# EAGLE schematic MOD-v1.1-1 (EAGLE 8.2.2)
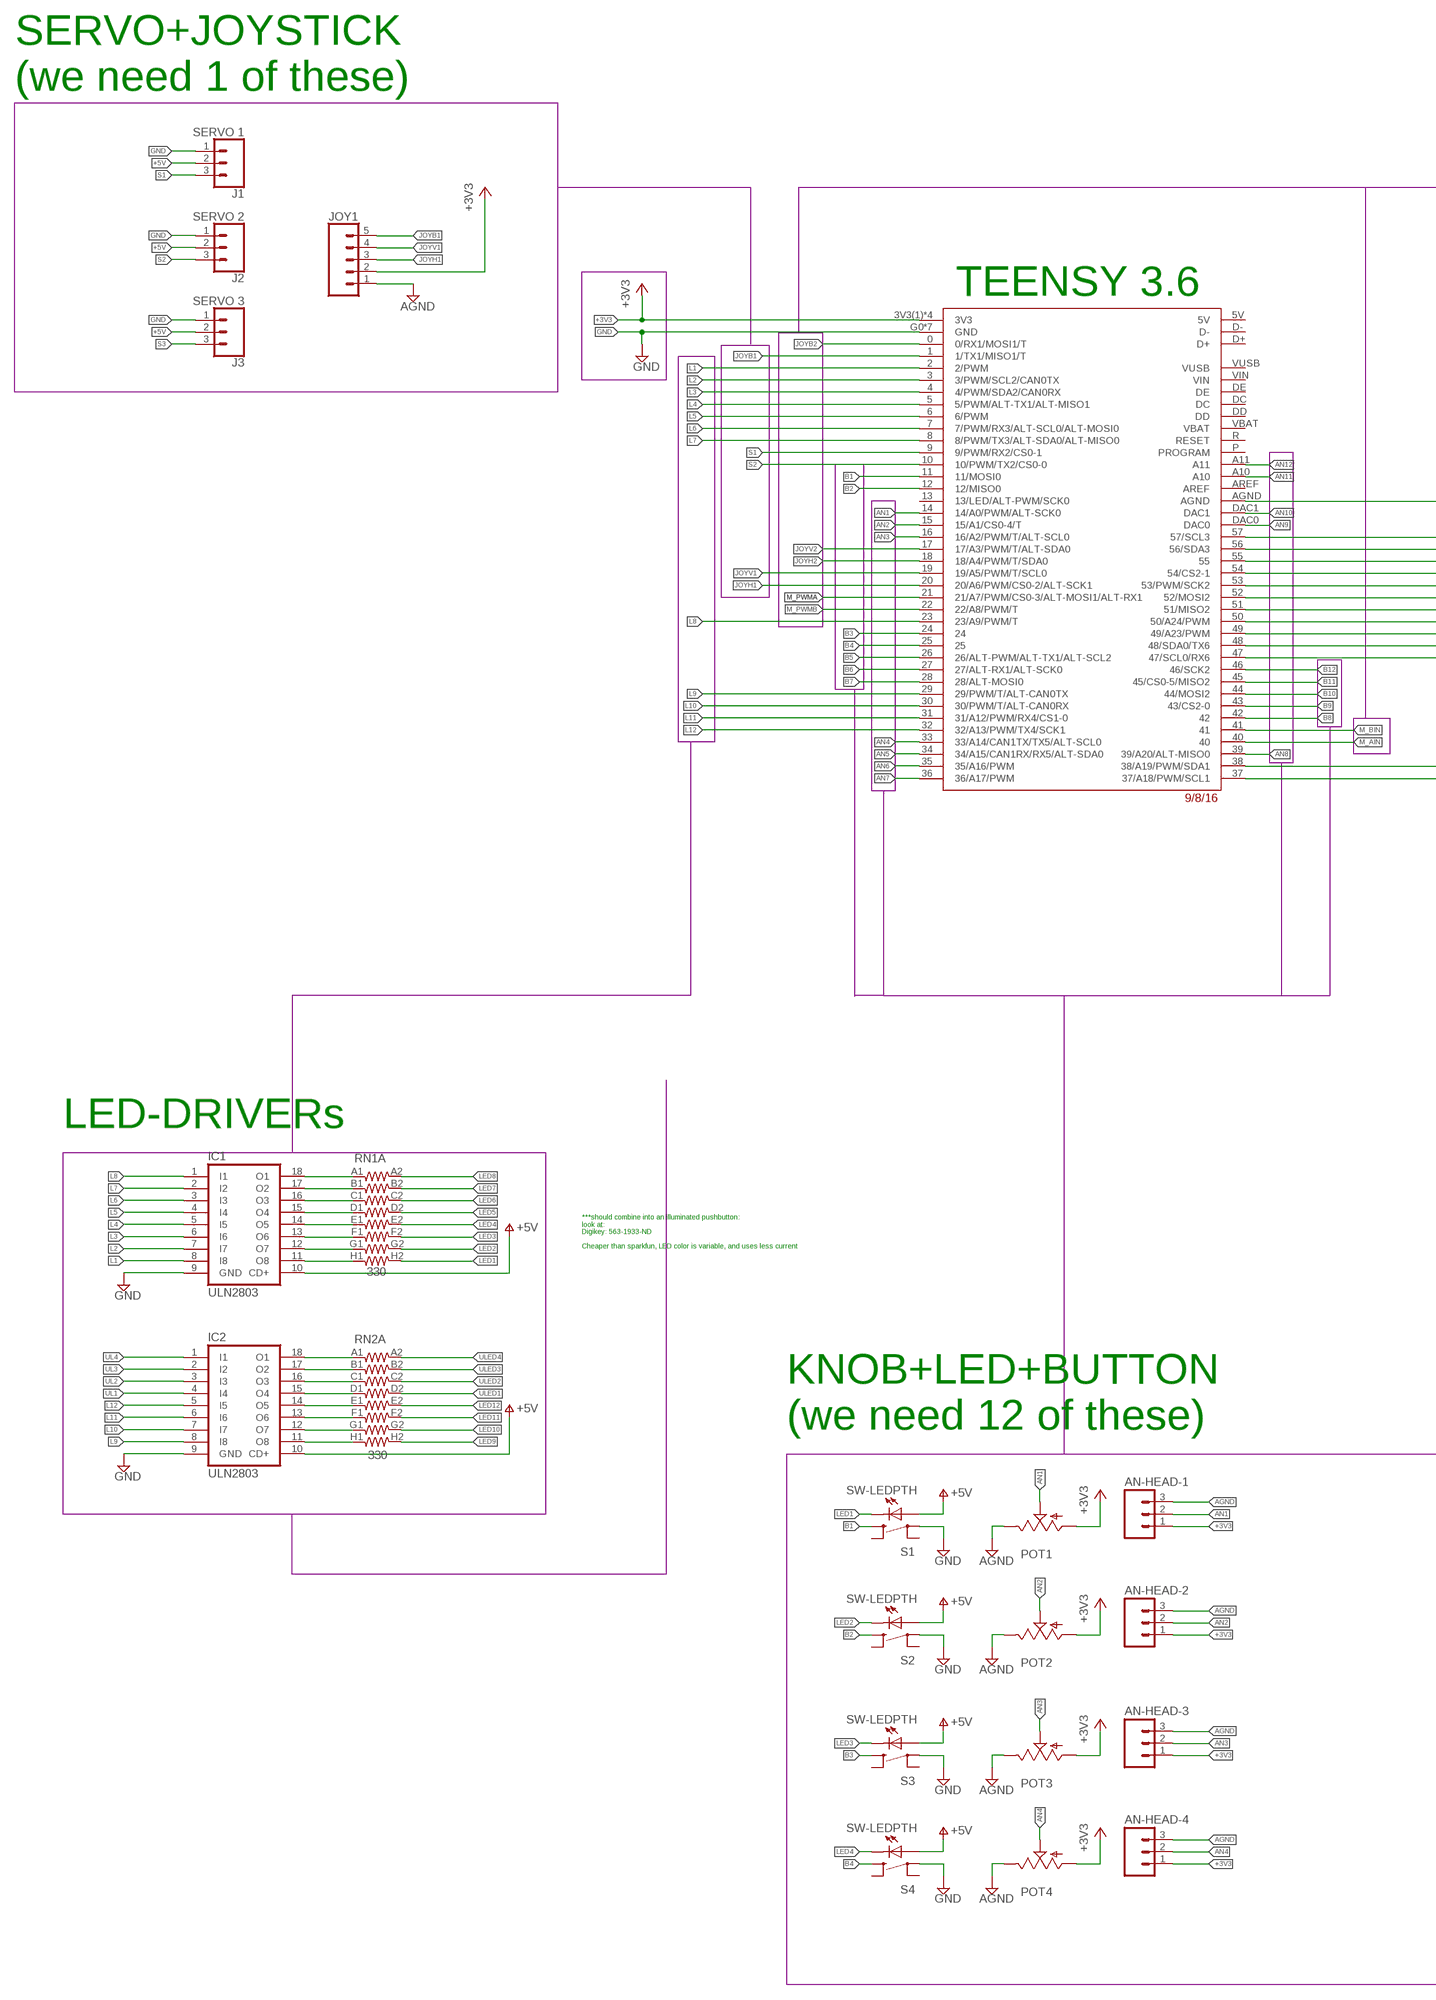
[diagram p0: schematic, sheet 1, part 1 of 2]
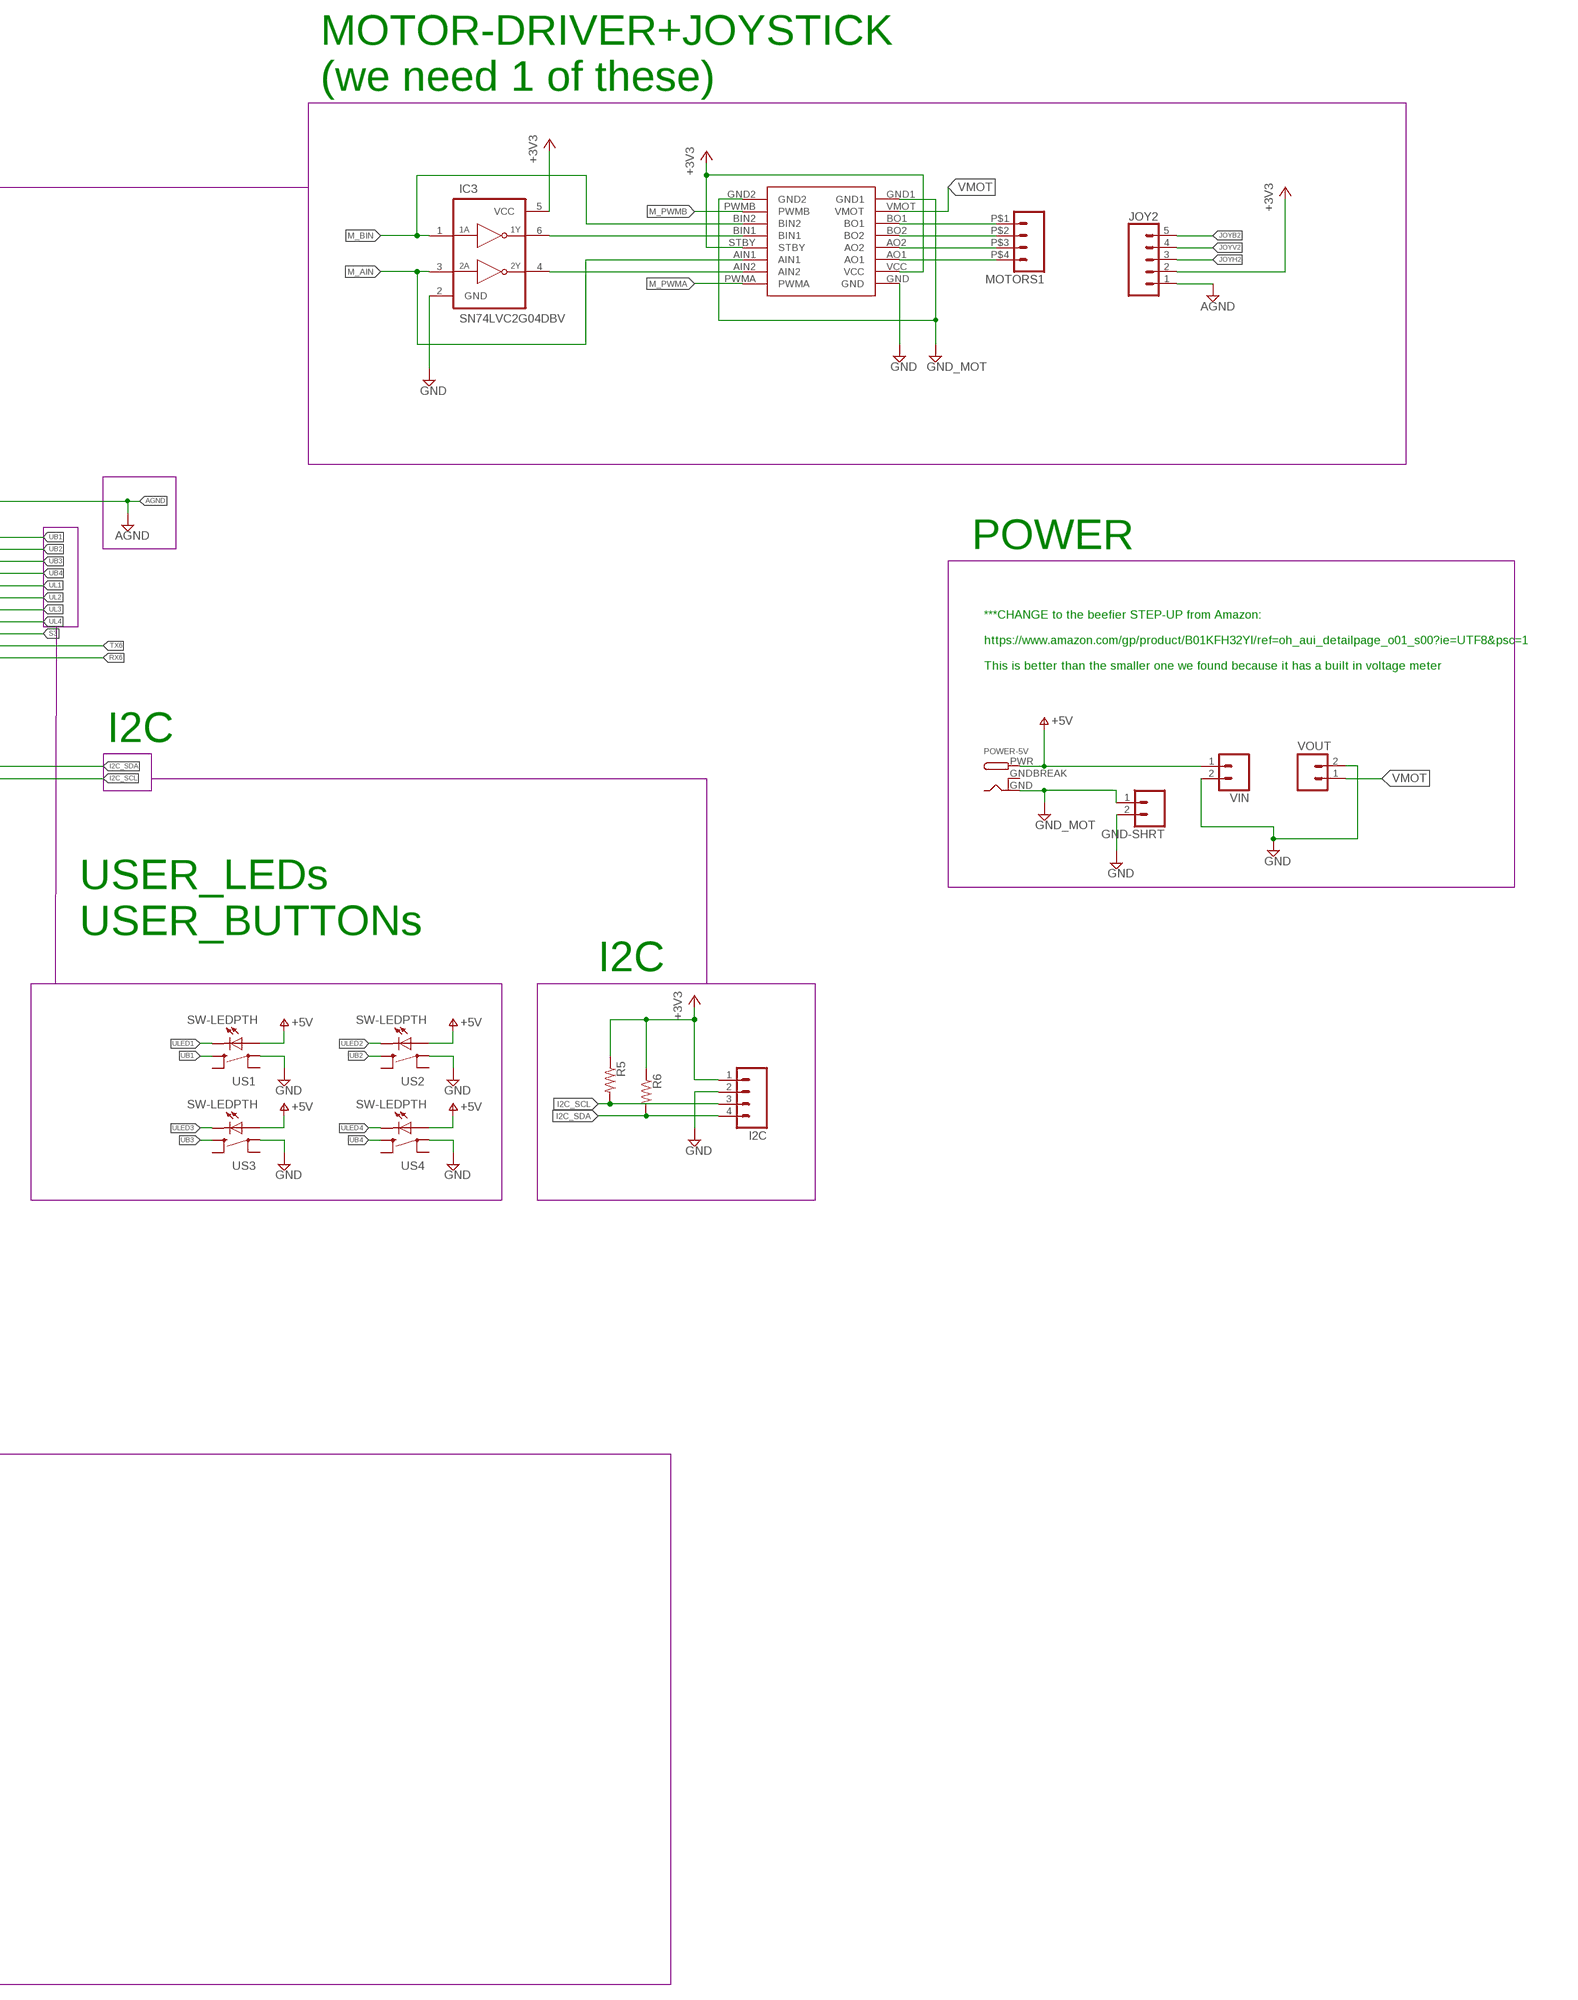
[diagram p1: schematic, sheet 1, part 2 of 2]

## Parts
AN-HEAD-1  M031X03_NO_SILK  [1X03_NO_SILK]
AN-HEAD-2  M031X03_NO_SILK  [1X03_NO_SILK]
AN-HEAD-3  M031X03_NO_SILK  [1X03_NO_SILK]
AN-HEAD-4  M031X03_NO_SILK  [1X03_NO_SILK]
GND-SHRT  M02LOCK  [1X02_LOCK]
I2C  M04LOCK  [1X04_LOCK]
IC1  ULN2803  ULN2803A  [DIL18]
IC2  ULN2803  ULN2803A  [DIL18]
IC3  SN74LVC2G04DBV  [SOT23-6]
J1  SERVO 1  CONN_03LOCK  [1X03_LOCK@1]
J2  SERVO 2  CONN_03LOCK  [1X03_LOCK@1]
J3  SERVO 3  CONN_03LOCK  [1X03_LOCK@1]
JOY1  CONN_05LOCK  [1X05_LOCK]
JOY2  CONN_05LOCK  [1X05_LOCK]
MOTORS1  M04  [SPRINGTERMINAL-2.54MM-4]
POT1  TRIM  [TRIM-PCB-9MM]
POT2  TRIM  [TRIM-PCB-9MM]
POT3  TRIM  [TRIM-PCB-9MM]
POT4  TRIM  [TRIM-PCB-9MM]
POWER-5V  DCBARRELPTH  [DCJACK_2MM_PTH]
R5  RESISTORPTH-1/6W  [1/6W-RES]
R6  RESISTORPTH-1/6W  [1/6W-RES]
RN1  330  RESISTOR-NET-8PDIL16  [RESISTOR-NET-8P-DIL16]
RN2  330  RESISTOR-NET-8PDIL16  [RESISTOR-NET-8P-DIL16]
S1  SW-LEDPTH  [TR2-SWITCH-MOMENTARY-LED]
S2  SW-LEDPTH  [TR2-SWITCH-MOMENTARY-LED]
S3  SW-LEDPTH  [TR2-SWITCH-MOMENTARY-LED]
S4  SW-LEDPTH  [TR2-SWITCH-MOMENTARY-LED]
TEENSY  TEENSY3_6--ALLPINS  [T36]
U$7  POLOLU_TB6612FNG  [POLOLU_TB6612FNG]
US1  SW-LEDPTH  [TR2-SWITCH-MOMENTARY-LED]
US2  SW-LEDPTH  [TR2-SWITCH-MOMENTARY-LED]
US3  SW-LEDPTH  [TR2-SWITCH-MOMENTARY-LED]
US4  SW-LEDPTH  [TR2-SWITCH-MOMENTARY-LED]
VIN  M02LOCK  [1X02_LOCK]
VOUT  M02LOCK  [1X02_LOCK]

## Nets
+3V3: AN-HEAD-1.1 AN-HEAD-2.1 AN-HEAD-3.1 AN-HEAD-4.1 I2C.1 IC3.5(VCC) JOY1.2 JOY2.2 POT1.1(A) POT2.1(A) POT3.1(A) POT4.1(A) R5.1 R6.1 TEENSY.3V3(1)(3V3) TEENSY.3V3(2)(3V3) TEENSY.3V3(3)(3V3) TEENSY.3V3(4)(3V3) U$7.STBY U$7.VCC
+5V [Power]: IC1.10(CD+) IC2.10(CD+) J1.2 J2.2 J3.2 POWER-5V.PWR VIN.1 ; supply symbol labelled V+
AGND [Analog Sig]: AN-HEAD-1.3 AN-HEAD-2.3 AN-HEAD-3.3 AN-HEAD-4.3 JOY1.1 JOY2.1 POT1.3(E) POT2.3(E) POT3.3(E) POT4.3(E) TEENSY.AGND
AN1 [Analog Sig]: AN-HEAD-1.2 POT1.2(S) TEENSY.14(14/A0/PWM/ALT-SCK0)
AN2 [Analog Sig]: AN-HEAD-2.2 POT2.2(S) TEENSY.15(15/A1/CS0-4/T)
AN3 [Analog Sig]: AN-HEAD-3.2 POT3.2(S) TEENSY.16(16/A2/PWM/T/ALT-SCL0)
AN4 [Analog Sig]: AN-HEAD-4.2 POT4.2(S) TEENSY.33(33/A14/CAN1TX/TX5/ALT-SCL0)
AN5 [Analog Sig]: TEENSY.34(34/A15/CAN1RX/RX5/ALT-SDA0)
AN6 [Analog Sig]: TEENSY.35(35/A16/PWM)
AN7 [Analog Sig]: TEENSY.36(36/A17/PWM)
AN8 [Analog Sig]: TEENSY.39(39/A20/ALT-MISO0)
AN9 [Analog Sig]: TEENSY.DAC0
AN10 [Analog Sig]: TEENSY.DAC1
AN11 [Analog Sig]: TEENSY.A10
AN12 [Analog Sig]: TEENSY.A11
B1: S1.1 TEENSY.11(11/MOSI0)
B2: S2.1 TEENSY.12(12/MISO0)
B3: S3.1 TEENSY.24
B4: S4.1 TEENSY.25
B5: TEENSY.26(26/ALT-PWM/ALT-TX1/ALT-SCL2)
B6: TEENSY.27(27/ALT-RX1/ALT-SCK0)
B7: TEENSY.28(28/ALT-MOSI0)
B8: TEENSY.42
B9: TEENSY.43(43/CS2-0)
B10: TEENSY.44(44/MOSI2)
B11: TEENSY.45(45/CS0-5/MISO2)
B12: TEENSY.46(46/SCK2)
GND: GND-SHRT.2 I2C.2 IC1.9(GND) IC2.9(GND) IC3.2(GND) J1.1 J2.1 J3.1 S1.3 S2.3 S3.3 S4.3 TEENSY.G0(GND) TEENSY.G1(GND) TEENSY.G2(GND) TEENSY.G3(GND) TEENSY.G4(GND) TEENSY.G5(GND) TEENSY.G6(GND) U$7.GND US1.3 US2.3 US3.3 US4.3 VIN.2 VOUT.2
GND_MOT [Power]: GND-SHRT.1 POWER-5V.GND U$7.GND1 U$7.GND2
I2C_SCL: I2C.3 R5.2
I2C_SDA: I2C.4 R6.2
JOYB1: JOY1.5 TEENSY.1(1/TX1/MISO1/T)
JOYB2: JOY2.5 TEENSY.0(0/RX1/MOSI1/T)
JOYH1 [Analog Sig]: JOY1.3 TEENSY.20(20/A6/PWM/CS0-2/ALT-SCK1)
JOYH2 [Analog Sig]: JOY2.3 TEENSY.18(18/A4/PWM/T/SDA0)
JOYV1 [Analog Sig]: JOY1.4 TEENSY.19(19/A5/PWM/T/SCL0)
JOYV2 [Analog Sig]: JOY2.4 TEENSY.17(17/A3/PWM/T/ALT-SDA0)
L1: IC1.8(I8) TEENSY.2(2/PWM)
L2: IC1.7(I7) TEENSY.3(3/PWM/SCL2/CAN0TX)
L3: IC1.6(I6) TEENSY.4(4/PWM/SDA2/CAN0RX)
L4: IC1.5(I5) TEENSY.5(5/PWM/ALT-TX1/ALT-MISO1)
L5: IC1.4(I4) TEENSY.6(6/PWM)
L6: IC1.3(I3) TEENSY.7(7/PWM/RX3/ALT-SCL0/ALT-MOSI0)
L7: IC1.2(I2) TEENSY.8(8/PWM/TX3/ALT-SDA0/ALT-MISO0)
L8: IC1.1(I1) TEENSY.23(23/A9/PWM/T)
L9: IC2.8(I8) TEENSY.29(29/PWM/T/ALT-CAN0TX)
L10: IC2.7(I7) TEENSY.30(30/PWM/T/ALT-CAN0RX)
L11: IC2.6(I6) TEENSY.31(31/A12/PWM/RX4/CS1-0)
L12: IC2.5(I5) TEENSY.32(32/A13/PWM/TX4/SCK1)
LED1: RN1.H2 S1.C
LED2: RN1.G2 S2.C
LED3: RN1.F2 S3.C
LED4: RN1.E2 S4.C
LED5: RN1.D2
LED6: RN1.C2
LED7: RN1.B2
LED8: RN1.A2
LED9: RN2.H2
LED10: RN2.G2
LED11: RN2.F2
LED12: RN2.E2
M_AIN: IC3.3(2A) TEENSY.40 U$7.AIN1
M_BIN: IC3.1(1A) TEENSY.41 U$7.BIN2
M_PWMA: TEENSY.21(21/A7/PWM/CS0-3/ALT-MOSI1/ALT-RX1) U$7.PWMA
M_PWMB: TEENSY.22(22/A8/PWM/T) U$7.PWMB
N$5: IC3.6(1Y) U$7.BIN1
N$6: IC3.4(2Y) U$7.AIN2
N$11: IC1.18(O1) RN1.A1
N$12: IC1.17(O2) RN1.B1
N$13: IC1.16(O3) RN1.C1
N$14: IC1.15(O4) RN1.D1
N$15: IC1.14(O5) RN1.E1
N$16: IC1.13(O6) RN1.F1
N$17: IC1.12(O7) RN1.G1
N$18: IC1.11(O8) RN1.H1
N$19: IC2.18(O1) RN2.A1
N$20: IC2.17(O2) RN2.B1
N$21: IC2.16(O3) RN2.C1
N$22: IC2.15(O4) RN2.D1
N$23: IC2.14(O5) RN2.E1
N$24: IC2.12(O7) RN2.G1
N$25: IC2.11(O8) RN2.H1
N$26: IC2.13(O6) RN2.F1
N$45 [Power]: MOTORS1.P$1 U$7.BO1
N$46 [Power]: MOTORS1.P$2 U$7.BO2
N$52 [Power]: MOTORS1.P$3 U$7.AO2
N$54 [Power]: MOTORS1.P$4 U$7.AO1
RX6: TEENSY.47(47/SCL0/RX6)
S1: J1.3 TEENSY.9(9/PWM/RX2/CS0-1)
S2: J2.3 TEENSY.10(10/PWM/TX2/CS0-0)
S3: J3.3 TEENSY.49(49/A23/PWM)
TX6: TEENSY.48(48/SDA0/TX6)
UB1: TEENSY.57(57/SCL3) US1.1
UB2: TEENSY.56(56/SDA3) US2.1
UB3: TEENSY.55 US3.1
UB4: TEENSY.54(54/CS2-1) US4.1
UL1: IC2.4(I4) TEENSY.53(53/PWM/SCK2)
UL2: IC2.3(I3) TEENSY.52(52/MOSI2)
UL3: IC2.2(I2) TEENSY.51(51/MISO2)
UL4: IC2.1(I1) TEENSY.50(50/A24/PWM)
ULED1: RN2.D2 US1.C
ULED2: RN2.C2 US2.C
ULED3: RN2.B2 US3.C
ULED4: RN2.A2 US4.C
V+: S1.A S2.A S3.A S4.A US1.A US2.A US3.A US4.A
VMOT [Power]: U$7.VMOT VOUT.1
Unconnected: S1.2 S1.4 S2.2 S2.4 S3.2 S3.4 S4.2 S4.4 TEENSY.5V TEENSY.13(13/LED/ALT-PWM/SCK0) TEENSY.37(37/A18/PWM/SCL1) TEENSY.38(38/A19/PWM/SDA1) TEENSY.AREF TEENSY.D+ TEENSY.D- TEENSY.DC TEENSY.DD TEENSY.DE TEENSY.P(PROGRAM) TEENSY.R(RESET) TEENSY.VBAT TEENSY.VIN TEENSY.VUSB US1.2 US1.4 US2.2 US2.4 US3.2 US3.4 US4.2 US4.4

## Notes on the sheet
- SERVO+JOYSTICK
  (we need 1 of these)
- MOTOR-DRIVER+JOYSTICK
  (we need 1 of these)
- TEENSY 3.6
- POWER
- ***CHANGE to the beefier STEP-UP from Amazon:
  
  https://www.amazon.com/gp/product/B01KFH32YI/ref=oh_aui_detailpage_o01_s00?ie=UTF8&psc=1
  
  This is better than the smaller one we found because it has a built in voltage meter
- I2C
- USER_LEDs
  USER_BUTTONs
- I2C
- LED-DRIVERs
- ***should combine into an illuminated pushbutton:
  look at:
  Digikey: 563-1933-ND
  
  Cheaper than sparkfun, LED color is variable, and uses less current
- KNOB+LED+BUTTON
  (we need 12 of these)

## Power pins joined to a net without a drawn wire
GNDBREAK: POWER-5V.GNDBREAK

## Library data of the parts
AN-HEAD-1-AN-HEAD-4 = SparkFun-Connectors:M03: Header 3 Standard 3-pin 0.1" header. Use with straight break away headers (SKU : PRT-00116), right angle break away headers (PRT-00553), swiss pins (PRT-00743), machine pins (PRT-00117), and female headers (PRT-00115). Molex polarized connector foot print use with SKU : PRT-08232 with associated crimp pins and housings.
GND-SHRT VIN VOUT = CMU-ArtFab:M02: Header 2 Standard 2-pin 0.1" header. Use with straight break away headers (SKU : PRT-00116), right angle break away headers (PRT-00553), swiss pins (PRT-00743), machine pins (PRT-00117), and female headers (PRT-00115). Molex polarized connector foot print use with SKU : PRT-08233 with associated crimp pins and housings.
I2C MOTORS1 = CMU-ArtFab:M04: Header 4 Standard 4-pin 0.1" header. Use with straight break away headers (SKU : PRT-00116), right angle break away headers (PRT-00553), swiss pins (PRT-00743), machine pins (PRT-00117), and female headers (PRT-00115). Molex polarized connector foot print use with SKU : PRT-08231 with associated crimp pins and housings. 1MM SMD Version SKU: PRT-10208
IC1 IC2 = uln-udn:ULN2803A: DRIVER ARRAY
IC3 = 74LV:SN74LVC2G04: DUAL INVERTER GATE
J1-J3 = SparkFun-Connectors:CONN_03: Multi connection point. Often used as Generic Header-pin footprint for 0.1 inch spaced/style header connections On any of the 0.1 inch spaced packages, you can populate with these: Break Away Headers - Straight <https://www.sparkfun.com/products/116> (PRT-00116) Break Away Male Headers - Right Angle <https://www.sparkfun.com/products/553> (PRT-00553) Female Headers <https://www.sparkfun.com/products/115> (PRT-00115) Break Away Headers - Machine Pin <https://www.sparkfun.com/products/117> (PRT-00117) Break Away Female Headers - Swiss Machine Pin <https://www.sparkfun.com/products/743> (PRT-00743) Stackable Header - 3 Pin (Female, 0.1") <https://www.sparkfun.com/products/13875> (PRT-13875) For SCREWTERMINALS and SPRING TERMINALS visit here: Screw Terimnals on SparkFun.com <https://www.sparkfun.com/search/results?term=Screw+Terminals> (5mm/3.5mm/2.54mm spacing) This device is also useful as a general connection point to wire up your design to another part of your project. Our various solder wires solder well into these plated through hole pads. Hook-Up Wire - Assortment (Stranded, 22 AWG) <https://www.sparkfun.com/products/11375> (PRT-11375) Hook-Up Wire - Assortment (Solid Core, 22 AWG) <https://www.sparkfun.com/products/11367> (PRT-11367) View the entire wire category on our website here <https://www.sparkfun.com/categories/141> Special notes: Molex polarized connector foot print use with SKU : PRT-08232 with associated crimp pins and housings.
JOY1 JOY2 = SparkFun-Connectors:CONN_05: Multi connection point. Often used as Generic Header-pin footprint for 0.1 inch spaced/style header connections On any of the 0.1 inch spaced packages, you can populate with these: Break Away Headers - Straight <https://www.sparkfun.com/products/116> (PRT-00116) Break Away Male Headers - Right Angle <https://www.sparkfun.com/products/553> (PRT-00553) Female Headers <https://www.sparkfun.com/products/115> (PRT-00115) Break Away Headers - Machine Pin <https://www.sparkfun.com/products/117> (PRT-00117) Break Away Female Headers - Swiss Machine Pin <https://www.sparkfun.com/products/743> (PRT-00743) For SCREWTERMINALS and SPRING TERMINALS visit here: Screw Terimnals on SparkFun.com <https://www.sparkfun.com/search/results?term=Screw+Terminals> (5mm/3.5mm/2.54mm spacing) This device is also useful as a general connection point to wire up your design to another part of your project. Our various solder wires solder well into these plated through hole pads. Hook-Up Wire - Assortment (Stranded, 22 AWG) <https://www.sparkfun.com/products/11375> (PRT-11375) Hook-Up Wire - Assortment (Solid Core, 22 AWG) <https://www.sparkfun.com/products/11367> (PRT-11367) View the entire wire category on our website here <https://www.sparkfun.com/categories/141> Special notes: Molex polarized connector foot print use with SKU : PRT-08231 with associated crimp pins and housings. 1MM SMD Version SKU: PRT-10208
POT1-POT4 = Daniel:TRIM
POWER-5V = adafruit:DCBARREL: 2.0mm DC Barrel Jack DCJACK_2MM_PTH - Through Hole Jack (4UConnector: 05537)
R5 R6 = SparkFun-Resistors:RESISTOR: Resistor Basic schematic elements and footprints for 0603, 1206, and PTH resistors.
RN1 RN2 = CMU-ArtFab:RESISTOR-NET-8P: CTS 742 Series 16 Terminations, 8 Resistors
S1-S4 US1-US4 = Daniel:SW-LED: SWITCH PUSH SPST-NO 10MA 12V
TEENSY = Teensy_3_6:TEENSY3_6--ALLPINS
U$7 = CMU-ArtFab:POLOLU_TB6612FNG

## Net classes
2 Power: width 0.381 mm, clearance 0.279 mm
3 Analog Sig: width 0.381 mm, clearance 0.279 mm